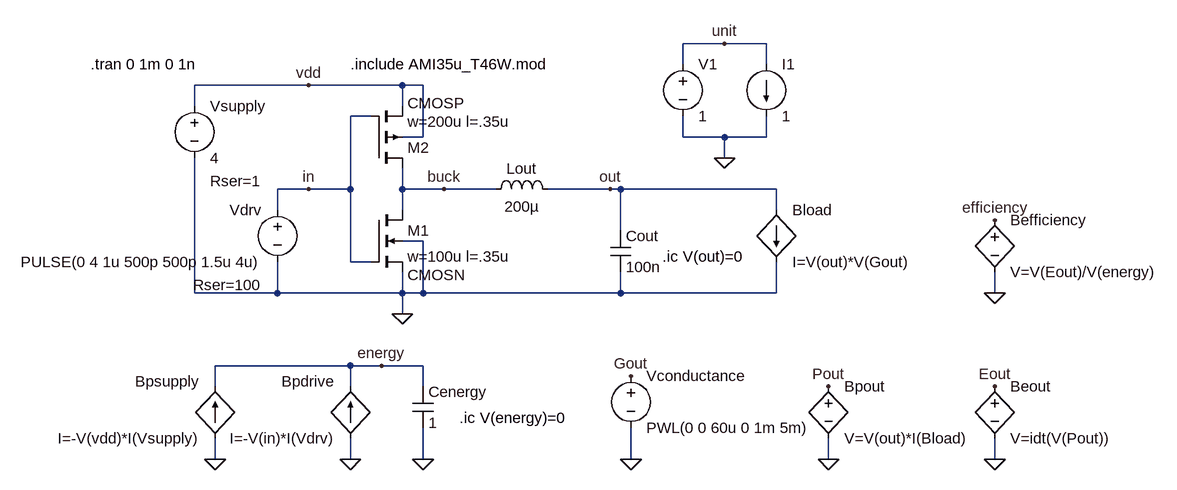
[diagram p0: schematic MorePowerPlay.asc]
MorePowerPlay.asc, the LTspice schematic file:
Version 4
SHEET 1 1560 680
WIRE 864 -64 800 -64
WIRE 928 -64 864 -64
WIRE 800 -32 800 -64
WIRE 928 -32 928 -64
WIRE 224 0 48 0
WIRE 368 0 224 0
WIRE 400 0 368 0
WIRE 48 32 48 0
WIRE 368 32 368 0
WIRE 320 48 288 48
WIRE 400 80 400 0
WIRE 400 80 368 80
WIRE 800 80 800 48
WIRE 864 80 800 80
WIRE 928 80 928 48
WIRE 928 80 864 80
WIRE 864 112 864 80
WIRE 224 160 176 160
WIRE 288 160 288 48
WIRE 288 160 224 160
WIRE 368 160 368 128
WIRE 432 160 368 160
WIRE 512 160 432 160
WIRE 688 160 592 160
WIRE 704 160 688 160
WIRE 944 160 704 160
WIRE 176 192 176 160
WIRE 368 192 368 160
WIRE 944 192 944 160
WIRE 704 224 704 160
WIRE 400 240 368 240
WIRE 288 272 288 160
WIRE 320 272 288 272
WIRE 48 320 48 112
WIRE 176 320 176 272
WIRE 176 320 48 320
WIRE 368 320 368 288
WIRE 368 320 176 320
WIRE 400 320 400 240
WIRE 400 320 368 320
WIRE 704 320 704 288
WIRE 704 320 400 320
WIRE 944 320 944 272
WIRE 944 320 704 320
WIRE 1280 320 1280 288
WIRE 368 352 368 320
WIRE 288 432 80 432
WIRE 336 432 288 432
WIRE 400 432 336 432
WIRE 80 464 80 432
WIRE 288 464 288 432
WIRE 400 464 400 432
WIRE 80 576 80 544
WIRE 288 576 288 544
WIRE 400 576 400 528
WIRE 720 576 720 528
WIRE 1024 576 1024 544
WIRE 1280 576 1280 544
FLAG 368 352 0
FLAG 224 0 vdd
FLAG 224 160 in
FLAG 688 160 out
FLAG 288 576 0
FLAG 80 576 0
FLAG 400 576 0
FLAG 336 432 energy
FLAG 432 160 buck
FLAG 720 576 0
FLAG 720 448 Gout
FLAG 864 112 0
FLAG 864 -64 unit
FLAG 1024 576 0
FLAG 1280 576 0
FLAG 1024 464 Pout
FLAG 1280 464 Eout
FLAG 1280 320 0
FLAG 1280 208 efficiency
SYMBOL nmos4 320 192 R0
WINDOW 38 56 100 Left 0
SYMATTR SpiceModel CMOSN
SYMATTR InstName M1
SYMATTR Value w=100u l=.35u
SYMBOL pmos4 320 128 M180
WINDOW 38 56 100 Left 0
SYMATTR SpiceModel CMOSP
SYMATTR InstName M2
SYMATTR Value w=200u l=.35u
SYMBOL voltage 48 16 R0
WINDOW 123 0 0 Left 0
WINDOW 39 24 132 Left 0
SYMATTR SpiceLine Rser=1
SYMATTR InstName Vsupply
SYMATTR Value 4
SYMBOL voltage 176 176 M0
WINDOW 123 0 0 Left 0
WINDOW 39 24 132 Left 0
SYMATTR SpiceLine Rser=100
SYMATTR InstName Vdrv
SYMATTR Value PULSE(0 4 1u 500p 500p 1.5u 4u)
SYMBOL bi 80 544 R180
WINDOW 0 24 88 Left 0
WINDOW 3 24 0 Left 0
SYMATTR InstName Bpsupply
SYMATTR Value I=-V(vdd)*I(Vsupply)
SYMBOL bi 288 544 R180
WINDOW 0 24 88 Left 0
WINDOW 3 24 0 Left 0
SYMATTR InstName Bpdrive
SYMATTR Value I=-V(in)*I(Vdrv)
SYMBOL cap 384 464 R0
SYMATTR InstName Cenergy
SYMATTR Value 1
SYMBOL cap 688 224 R0
SYMATTR InstName Cout
SYMATTR Value 100n
SYMBOL ind 496 176 R270
WINDOW 0 32 56 VTop 0
WINDOW 3 5 56 VBottom 0
SYMATTR InstName Lout
SYMATTR Value 200µ
SYMBOL bi 944 192 R0
SYMATTR InstName Bload
SYMATTR Value I=V(out)*V(Gout)
SYMBOL voltage 720 432 R0
WINDOW 123 0 0 Left 0
WINDOW 39 24 132 Left 0
SYMATTR InstName Vconductance
SYMATTR Value PWL(0 0 60u 0 1m 5m)
SYMBOL voltage 800 -48 R0
SYMATTR InstName V1
SYMATTR Value 1
SYMBOL current 928 -32 R0
SYMATTR InstName I1
SYMATTR Value 1
SYMBOL bv 1024 448 R0
SYMATTR InstName Bpout
SYMATTR Value V=V(out)*I(Bload)
SYMBOL bv 1280 448 R0
SYMATTR InstName Beout
SYMATTR Value V=idt(V(Pout))
SYMBOL bv 1280 192 R0
SYMATTR InstName Befficiency
SYMATTR Value V=V(Eout)/V(energy)
TEXT 288 -32 Left 0 !.include AMI35u_T46W.mod
TEXT -112 -32 Left 0 !.tran 0 1m 0 1n
TEXT 456 512 Left 0 !.ic V(energy)=0
TEXT 768 264 Left 0 !.ic V(out)=0

The netlist it stands for:
* MorePowerPlay.asc
M1 buck in 0 0 CMOSN w=100u l=.35u
M2 buck in vdd vdd CMOSP w=200u l=.35u
Vsupply vdd 0 4 Rser=1
Vdrv in 0 PULSE(0 4 1u 500p 500p 1.5u 4u) Rser=100
Bpsupply 0 energy I=-V(vdd)*I(Vsupply)
Bpdrive 0 energy I=-V(in)*I(Vdrv)
Cenergy energy 0 1
Cout out 0 100n
Lout buck out 200µ
Bload out 0 I=V(out)*V(Gout)
Vconductance Gout 0 PWL(0 0 60u 0 1m 5m)
V1 unit 0 1
I1 unit 0 1
Bpout Pout 0 V=V(out)*I(Bload)
Beout Eout 0 V=idt(V(Pout))
Befficiency efficiency 0 V=V(Eout)/V(energy)
.model NMOS NMOS
.model PMOS PMOS
.lib standard.mos
.include AMI35u_T46W.mod
.tran 0 1m 0 1n
.ic V(energy)=0
.ic V(out)=0
.backanno
.end